# EAGLE schematic MOSFET Board (EAGLE 9.3.2)
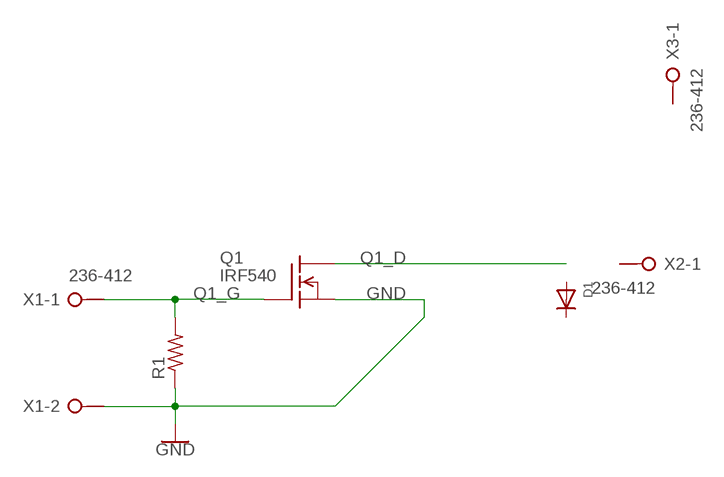
[diagram p0: schematic, sheet 1]

## Parts
D1  DIODESMA  [SMADIODE]
Q1  IRF540  [TO220]
R1  R-US_0204/2V  [0204V]
X1  236-412  [236-412]
X2  236-412  [236-412]
X3  236-412  [236-412]

## Nets
GND: Q1.3(S) R1.1 X1.2@1(-2:KL1)
Q1_D: Q1.2(D)
Q1_G: Q1.1(G) R1.2 X1.1@1(-1:KL1)
Unconnected: D1.A D1.C X1.1@2(-1:KL2) X1.2@2(-2:KL2) X1.3@1(-3:KL1) X1.3@2(-3:KL2) X1.4@1(-4:KL1) X1.4@2(-4:KL2) X1.5@1(-5:KL1) X1.5@2(-5:KL2) X1.6@1(-6:KL1) X1.6@2(-6:KL2) X1.7@1(-7:KL1) X1.7@2(-7:KL2) X1.8@1(-8:KL1) X1.8@2(-8:KL2) X1.9@1(-9:KL1) X1.9@2(-9:KL2) X1.10@1(-10:KL1) X1.10@2(-10:KL2) X1.11@1(-11:KL1) X1.11@2(-11:KL2) X1.12@1(-12:KL1) X1.12@2(-12:KL2) X2.1@1(-1:KL1) X2.1@2(-1:KL2) X2.2@1(-2:KL1) X2.2@2(-2:KL2) X2.3@1(-3:KL1) X2.3@2(-3:KL2) X2.4@1(-4:KL1) X2.4@2(-4:KL2) X2.5@1(-5:KL1) X2.5@2(-5:KL2) X2.6@1(-6:KL1) X2.6@2(-6:KL2) X2.7@1(-7:KL1) X2.7@2(-7:KL2) X2.8@1(-8:KL1) X2.8@2(-8:KL2) X2.9@1(-9:KL1) X2.9@2(-9:KL2) X2.10@1(-10:KL1) X2.10@2(-10:KL2) X2.11@1(-11:KL1) X2.11@2(-11:KL2) X2.12@1(-12:KL1) X2.12@2(-12:KL2) X3.1@1(-1:KL1) X3.1@2(-1:KL2) X3.2@1(-2:KL1) X3.2@2(-2:KL2) X3.3@1(-3:KL1) X3.3@2(-3:KL2) X3.4@1(-4:KL1) X3.4@2(-4:KL2) X3.5@1(-5:KL1) X3.5@2(-5:KL2) X3.6@1(-6:KL1) X3.6@2(-6:KL2) X3.7@1(-7:KL1) X3.7@2(-7:KL2) X3.8@1(-8:KL1) X3.8@2(-8:KL2) X3.9@1(-9:KL1) X3.9@2(-9:KL2) X3.10@1(-10:KL1) X3.10@2(-10:KL2) X3.11@1(-11:KL1) X3.11@2(-11:KL2) X3.12@1(-12:KL1) X3.12@2(-12:KL2)

## Library data of the parts
D1 = adafruit:DIODE: Diode SMADIODE - SMA Surface Mount Package 20V 1A Schottky Diode Digikey: 641-1014-6-ND DO-1N4148 - Through Hole Small Current Diode SOD-123 20V 1 A (.5mV Vf) Schottky Diode - Digikey: MBRX120TPMSCT-ND SOD-323 10V 570mA (.38mV Vf, 3ns) Schottky Diode - Digikey: ZLLS410CT-ND SOD-523 30V 30mA Schottky Diode (RB751S-40TE61) - Digikey: RB751S-40TE61CT-ND SOT23-R/W - SOT23 Package (R = Solder Paste/Reflow Ovens, W = Hand-Soldering) BAT54Film 40V 300mA - Digikey: 497-7162-1-ND
Q1 = transistor-fet:IRF540: N-Channel Enhancement MOSFET (HEXFET); 100V; 28A; 0,077Ohm
R1 = adafruit:R-US_: RESISTOR, American symbol
X1-X3 = con-wago-508:236-412: Terminal Strips 2.5 mm2/AWG 12, Series 236, Pin Spacings 5/5.08 mm Source: Data sheet <http://www.farnell.com/datasheets/63479.pdf>; MF: Wago Corporation; MPN: 0236-0412; OC_FARNELL: 1283531; OC_NEWARK: 79K2064